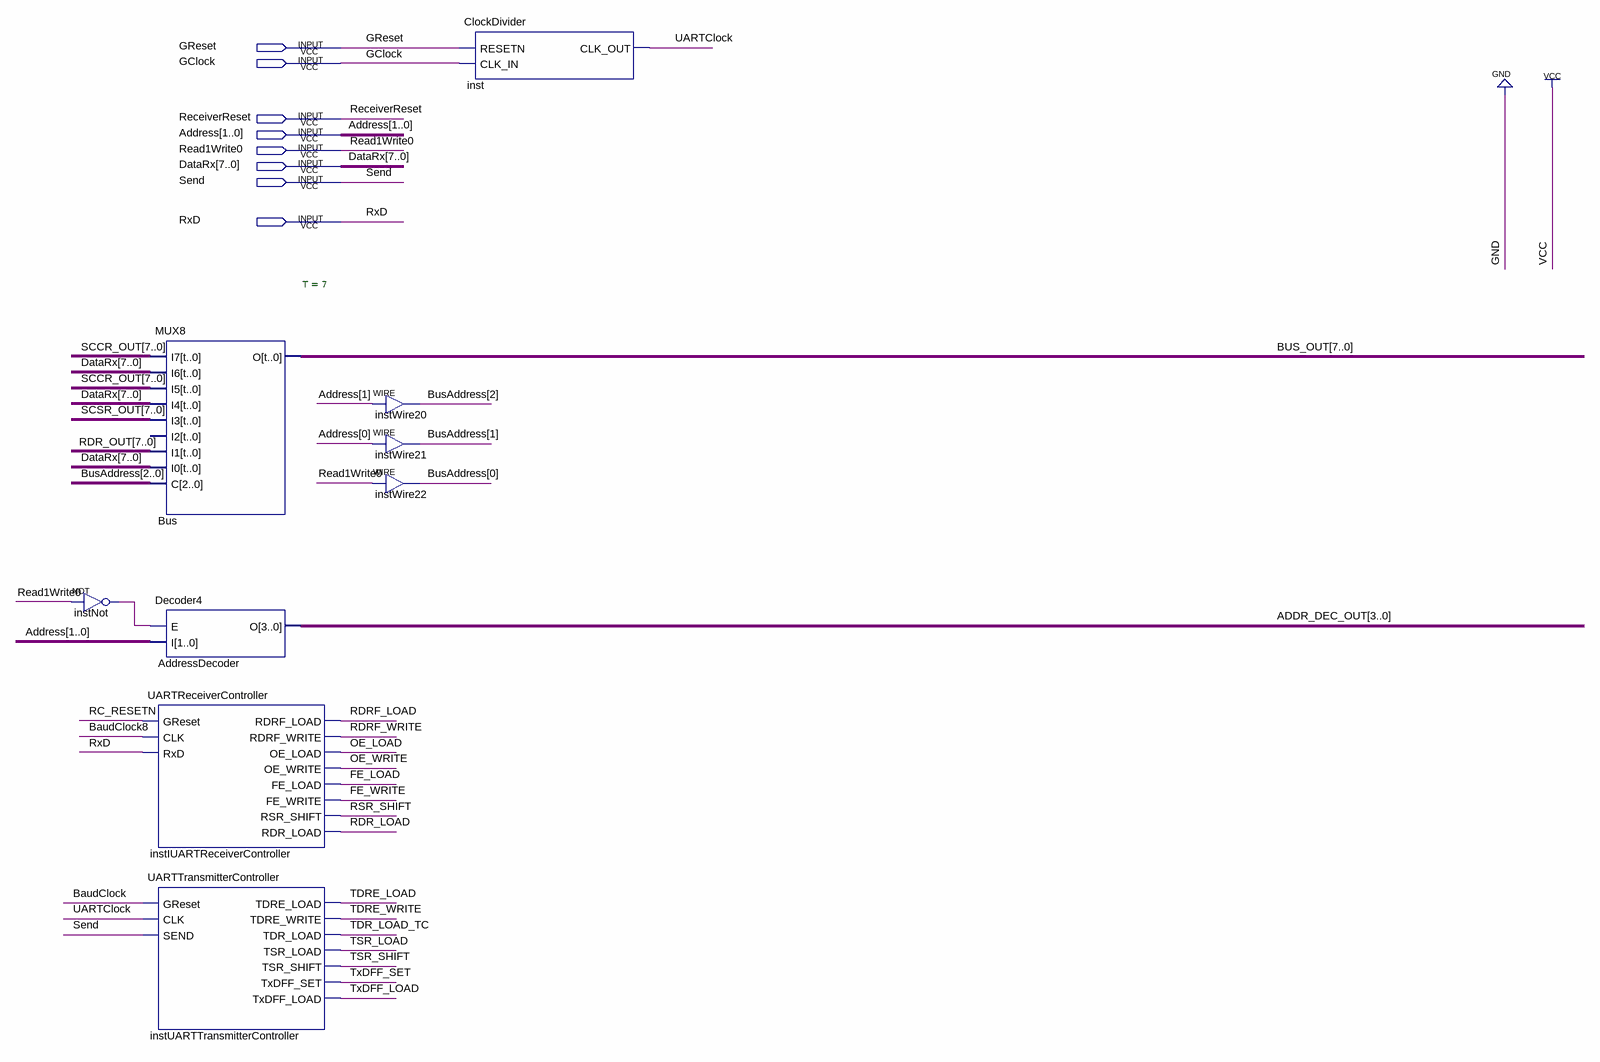
[diagram p0: schematic sheet]
// Quartus schematic UART.bdf as structural Verilog: 9 symbols, 8 pins
module UART (
  input  GReset,
  input  GClock,
  input  ReceiverReset,
  input  [1:0] Address,
  input  Read1Write0,
  input  [7:0] DataRx,
  input  Send,
  input  RxD
);

  wire BaudClock, BaudClock8, FE_LOAD, FE_WRITE, instNot_out, OE_LOAD, OE_WRITE, RC_RESETN, RDR_LOAD,
       RDRF_LOAD, RDRF_WRITE, RSR_SHIFT, TDR_LOAD_TC, TDRE_LOAD, TDRE_WRITE, TSR_LOAD, TSR_SHIFT, TxDFF_LOAD,
       TxDFF_SET, UARTClock;
  wire [2:0] BusAddress;
  wire [3:0] ADDR_DEC_OUT;
  wire [7:0] BUS_OUT, RDR_OUT, SCCR_OUT, SCSR_OUT;

  not instNot (instNot_out, Read1Write0);
  MUX8 #(.T(7)) Bus (
    .I7(SCCR_OUT), .I6(DataRx), .I5(SCCR_OUT), .I4(DataRx), .I3(SCSR_OUT), .I1(RDR_OUT), .I0(DataRx),
    .C(BusAddress), .O(BUS_OUT));  // open: I2
  Decoder4 AddressDecoder (.E(instNot_out), .I(Address), .O(ADDR_DEC_OUT));
  UARTReceiverController instIUARTReceiverController (
    .GReset(RC_RESETN), .CLK(BaudClock8), .RxD(RxD), .RDRF_LOAD(RDRF_LOAD), .RDRF_WRITE(RDRF_WRITE),
    .OE_LOAD(OE_LOAD), .OE_WRITE(OE_WRITE), .FE_LOAD(FE_LOAD), .FE_WRITE(FE_WRITE), .RSR_SHIFT(RSR_SHIFT),
    .RDR_LOAD(RDR_LOAD));
  UARTTransmitterController instUARTTransmitterController (
    .GReset(BaudClock), .CLK(UARTClock), .SEND(Send), .TDRE_LOAD(TDRE_LOAD), .TDRE_WRITE(TDRE_WRITE),
    .TDR_LOAD(TDR_LOAD_TC), .TSR_LOAD(TSR_LOAD), .TSR_SHIFT(TSR_SHIFT), .TxDFF_SET(TxDFF_SET),
    .TxDFF_LOAD(TxDFF_LOAD));
  assign BusAddress[2] = Address[1];  // WIRE instWire20
  assign BusAddress[1] = Address[0];  // WIRE instWire21
  assign BusAddress[0] = Read1Write0;  // WIRE instWire22
  ClockDivider inst (.RESETN(GReset), .CLK_IN(GClock), .CLK_OUT(UARTClock));
endmodule
